# EasyEDA Pro project 酒精视觉检测.eprj

# Schematic 酒精疲劳检测
Board Name: Board1; Create Date: 2025-12-30; Page Name: P1; Project Name: 酒精视觉检测; Schematic Name: 酒精疲劳检测; Update Date: 2025-12-30; Company: 嘉立创EDA; Page Size: A4; Version: V1.0
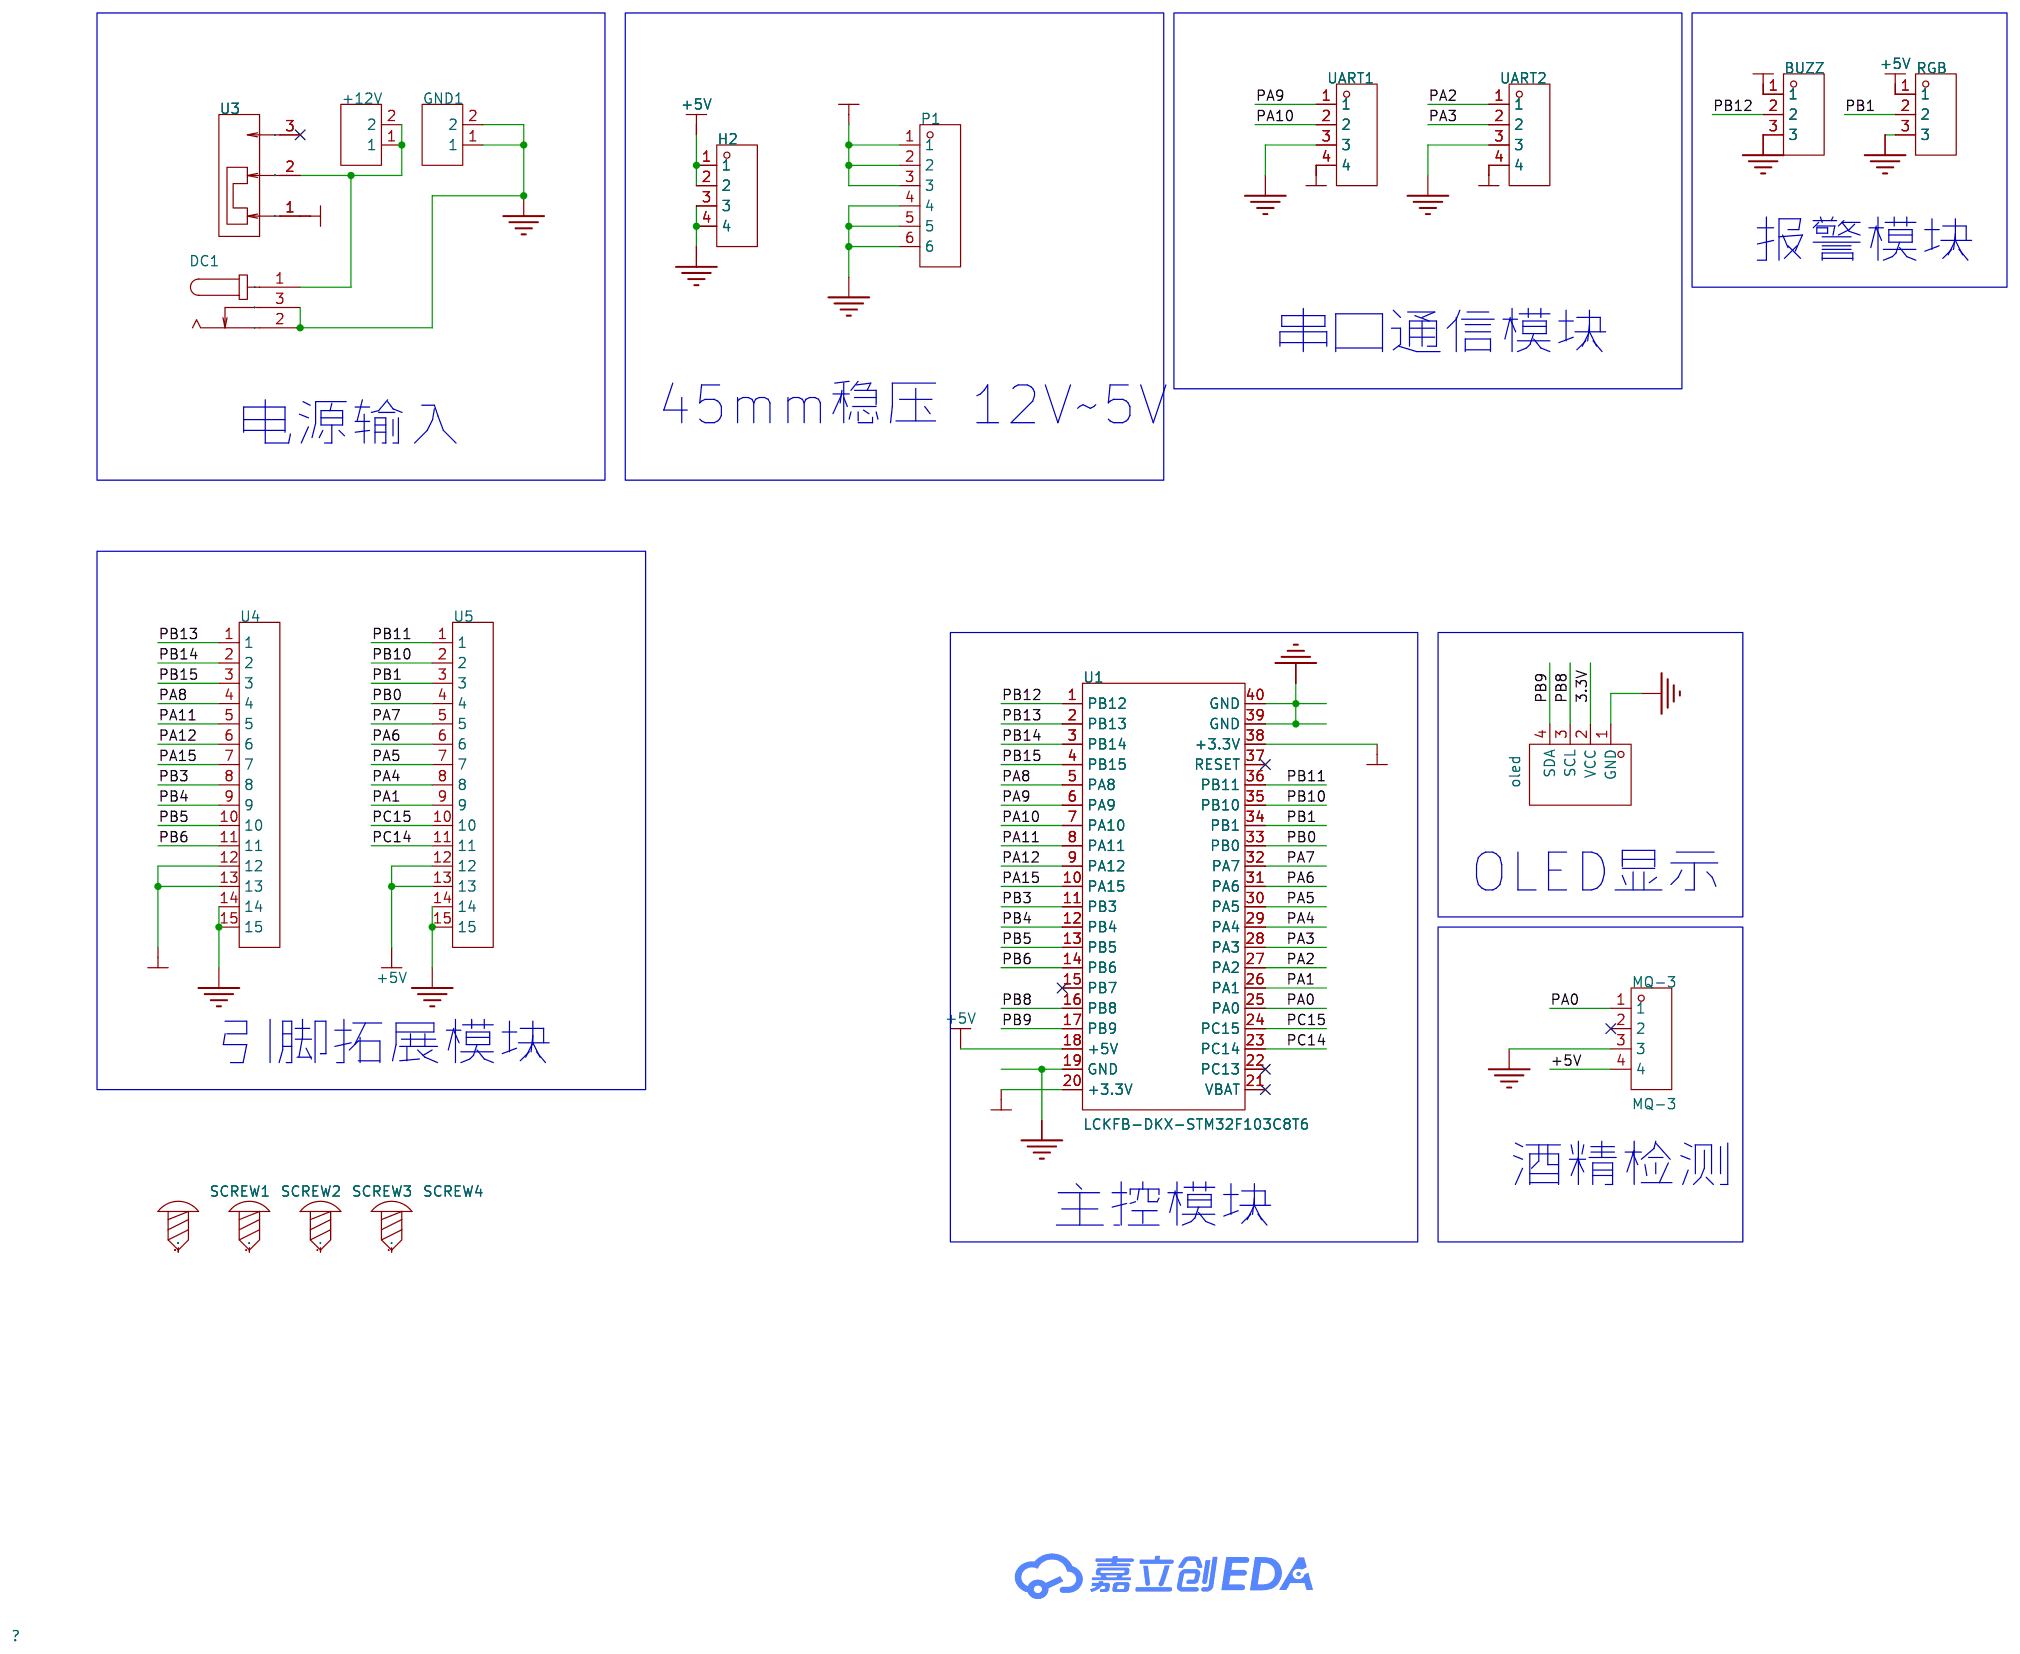
[diagram p0: schematic sheet]

## Parts
+12V  Z-211-0211-0021-001  [HDR-TH_2P-P2.54-V-M-1]
BUZZ  HC-PM254-8.5H-1x3PZ-02A  [HDR-TH_3P-P2.54-V-F]
DC1  DC005-T  [DC-IN-TH_DC005-T]
GND1  Z-211-0211-0021-001  [HDR-TH_2P-P2.54-V-M-1]
H2  2.54-1*4P母  [HDR-TH_4P-P2.54-V-F]
MQ-3  MQ-3  [HDR-TH_4P-P2.54-V-F]
oled  HS96L03W2C03  [OLED-TH_L27.8-W27.2-P2.54_C9900033791]
P1  2.54-1*6P母  [HDR-TH_6P-P2.54-V-F]
RGB  HC-PM254-8.5H-1x3PZ-02A  [HDR-TH_3P-P2.54-V-F]
SCREW1  -  [M2螺丝]
SCREW2  -  [M2螺丝]
SCREW3  -  [M2螺丝]
SCREW4  -  [M2螺丝]
U1  LCKFB-DKX-STM32F103C8T6  [CONN-TH_L53.3-W22.9_STM32F103C8T6-CARD]
U3  SS-12D10-G5  [SW-TH_SS-12D10-G050]
U4  ZX-PZ2.54-1-15PZZ  [HDR-TH_15P-P2.54-V-M]
U5  ZX-PZ2.54-1-15PZZ  [HDR-TH_15P-P2.54-V-M]
UART1  PZ254V-11-04P  [HDR-TH_4P-P2.54-V-M]
UART2  PZ254V-11-04P  [HDR-TH_4P-P2.54-V-M]

## Library data of the parts
+12V GND1 = Z-211-0211-0021-001: LCSC Part Name: 1x2P 间距:2.54mm 方针 直插; Supplier Part: C152154; Manufacturer: Nextron(正凌); Supplier Footprint: 插件,P=2.54mm; JLCPCB Part Class: 扩展库; Datasheet: https://item.szlcsc.com/datasheet/Z-211-0211-0021-001/163494.html; Supplier: LCSC; Pin Structure: 1x2P; Pitch: 2.54mm; Circluar Pins/Square Pins: 方针; Mounting Type: 直插; Number of Rows: 单排; Number of Pins: 2P; Length of Mating Pin: 6mm; Insulation Height: 2.5mm; Length of End Connection Pin: 3mm; Contact Material: 黄铜; Operating Temperature: -25℃~+105℃; Color: 黑色
BUZZ RGB = HC-PM254-8.5H-1x3PZ-02A: LCSC Part Name: 间距2.54mm 1x3Pin 直插 PC3.0 H8.5; Supplier Part: C22373889; Manufacturer: HC(虹成电子); Supplier Footprint: 插件,P=2.54mm; JLCPCB Part Class: 扩展库; Datasheet: https://item.szlcsc.com/datasheet/HC-PM254-8.5H-1x3PZ-02A/23870225.html; Supplier: LCSC; Holes Structure: 1x3P; Pitch: 2.54mm; Circular Hole / Square Hole: 方孔; Mounting Type: 直插; Number of Rows: 单排; Number of Positions: 3P; Current Rating: 3A; Holes Direction: 顶部; Insulation Height: 8.5mm; Contact Material: 黄铜; Contact Plating: 金; Operating Temperature: -40℃~+105℃; PIN Length: 3mm
DC1 = DC005-T: LCSC Part Name: DC电源插座 内径:2mm 外径:6.3mm; Supplier Part: C431532; Manufacturer: SHOU HAN(首韩); Supplier Footprint: 插件; JLCPCB Part Class: 扩展库; Datasheet: https://item.szlcsc.com/datasheet/DC005-T/427889.html; Supplier: LCSC; Connector Type: DC电源插座; Mounting Type: 弯插; Inside Contact Diameter: 2mm; Outside Contact Diameter: 6.3mm; Current Rating: 1.5A; Voltage Rating (Max): 12V; Operating Temperature: -30℃~+70℃
H2 = 2.54-1*4P母: LCSC Part Name: 间距:2.54mm 1x4P 直插; Supplier Part: C2718488; Manufacturer: BOOMELE(博穆精密); Supplier Footprint: 插件,P=2.54mm; JLCPCB Part Class: 扩展库; Datasheet: https://item.szlcsc.com/datasheet/2.54-1*4P%25E6%25AF%258D/2834502.html; Supplier: LCSC; Holes Structure: 1x4P; Pitch: 2.54mm; Circular Hole / Square Hole: 方孔; Mounting Type: 直插; Number of Rows: 单排; Number of Positions: 4P; Current Rating: 3A; Holes Direction: 顶部; Contact Material: 青铜; Operating Temperature: -40℃~+105℃
MQ-3 = PM254V-11-04-H85: LCSC Part Name: 1x4P 间距:2.54mm 直插; Supplier Part: C541851; Manufacturer: XFCN(兴飞); Supplier Footprint: 插件,P=2.54mm; JLCPCB Part Class: 扩展库; Datasheet: https://item.szlcsc.com/datasheet/PM254V-11-04-H85/562472.html; Supplier: LCSC; Holes Structure: 1x4P; Pitch: 2.54mm; Circular Hole / Square Hole: 方孔; Mounting Type: 直插; Number of Rows: 单排; Number of Positions: 4P; Current Rating: 3A; Holes Direction: 顶部; Insulation Height: 8.5mm; Contact Material: 黄铜; Operating Temperature: -40℃~+105℃
oled = HS96L03W2C03: LCSC Part Name: 0.96寸OLED显示屏窄白光IIC; Supplier Part: C5248080; Manufacturer: HS(汉昇); JLCPCB Part Class: 扩展库; Datasheet: https://atta.szlcsc.com/upload/public/pdf/source/20230627/763D01F79A90007632F098068C7C8AD9.pdf; Supplier: LCSC; Main Control Chip: SSD1315; Interface Type: I2C; Size: 0.96; Pixel Resolution: 128x64; Operating Temperature: -40℃~+70℃
P1 = 2.54-1*6P母: LCSC Part Name: 1x6P 间距:2.54mm 直插; Supplier Part: C40877; Manufacturer: BOOMELE(博穆精密); Supplier Footprint: 插件,P=2.54mm; JLCPCB Part Class: 扩展库; Datasheet: https://item.szlcsc.com/datasheet/2.54-1*6P%25E6%25AF%258D/41861.html; Supplier: LCSC; Holes Structure: 1x6P; Pitch: 2.54mm; Circular Hole / Square Hole: 方孔; Mounting Type: 直插; Number of Rows: 单排; Number of Positions: 6P; Current Rating: 3A; Holes Direction: 顶部; Contact Material: 黄铜; Operating Temperature: -40℃~+105℃; PIN Length: 3.3mm
SCREW1-SCREW4 = M2螺丝: Supplier Footprint: 插件
U1 = LCKFB-DKX-STM32F103C8T6: LCSC Part Name: 立创·地阔星-STM32F103C8T6开发板; Supplier Part: C22396880; Manufacturer: 立创开发板; JLCPCB Part Class: 扩展库; Datasheet: https://item.szlcsc.com/datasheet/LCKFB-DKX-STM32F103C8T6/24005615.html; Supplier: LCSC
U3 = SS-12D10-G5: LCSC Part Name: 插件大电流拨动开关; Supplier Part: C2998777; Manufacturer: DEALON(德艺隆); Supplier Footprint: 插件,12.7x6.7mm; JLCPCB Part Class: 扩展库; Datasheet: https://item.szlcsc.com/datasheet/SS-12D10-G5/3473878.html; Supplier: LCSC; Circuit: 单刀双掷; Actuator Style: 矩形柱状; Termination Style: PC引脚; Length: 12.7mm; Width: 6.7mm; Switch Height: 11.3mm; Mounting Type: 直插; Actuator Color: 黑色
U4 U5 = ZX-PZ2.54-1-15PZZ: LCSC Part Name: 1x15P 间距:2.54mm 方针 直插; Supplier Part: C7501269; Manufacturer: Megastar(兆星); Supplier Footprint: 插件,P=2.54mm; JLCPCB Part Class: 扩展库; Datasheet: https://item.szlcsc.com/datasheet/ZX-PZ2.54-1-15PZZ/8582482.html; Supplier: LCSC; Pin Structure: 1x15P; Pitch: 2.54mm; Circluar Pins/Square Pins: 方针; Mounting Type: 直插; Number of Rows: 单排; Number of Pins: 15P; Current Rating: 3A; Length of Mating Pin: 6mm; Insulation Height: 2.5mm; Length of End Connection Pin: 3mm; Contact Material: 黄铜; Contact Plating: 金; Operating Temperature: -40℃~+105℃; Color: 黑色
UART1 UART2 = PZ254V-11-04P: LCSC Part Name: 1x4P 间距:2.54mm 方针 直插; Supplier Part: C2691448; Manufacturer: XFCN(兴飞); Supplier Footprint: 插件,P=2.54mm; JLCPCB Part Class: 扩展库; Datasheet: https://item.szlcsc.com/datasheet/PZ254V-11-04P/2801085.html; Supplier: LCSC; Pin Structure: 1x4P; Pitch: 2.54mm; Circluar Pins/Square Pins: 方针; Mounting Type: 直插; Number of Rows: 单排; Number of Pins: 4P; Current Rating: 3A; Voltage Rating (Max): 250V; Length of Mating Pin: 6mm; Insulation Height: 2.5mm; Length of End Connection Pin: 3mm; Operating Temperature: -40℃~+105℃; Color: 黑色

## Nets
3.3V: BUZZ.1 oled.2(VCC) U1.20(+3.3V) U1.38(+3.3V) U4.12 U4.13 UART1.4 UART2.4
+5V: H2.1 H2.2 MQ-3.4 RGB.1 U1.18(+5V) U5.12 U5.13
+12V: P1.1 P1.2 P1.3 U3.1
GND: BUZZ.3 DC1.2 DC1.3 GND1.1 GND1.2 H2.3 H2.4 MQ-3.3 oled.1(GND) P1.4 P1.5 P1.6 RGB.3 U1.19(GND) U1.39(GND) U1.40(GND) U4.14 U4.15 U5.14 U5.15 UART1.3 UART2.3
PA0: MQ-3.1 U1.25(PA0)
PA1: U1.26(PA1) U5.9
PA2: U1.27(PA2) UART2.1
PA3: U1.28(PA3) UART2.2
PA4: U1.29(PA4) U5.8
PA5: U1.30(PA5) U5.7
PA6: U1.31(PA6) U5.6
PA7: U1.32(PA7) U5.5
PA8: U1.5(PA8) U4.4
PA9: U1.6(PA9) UART1.1
PA10: U1.7(PA10) UART1.2
PA11: U1.8(PA11) U4.5
PA12: U1.9(PA12) U4.6
PA15: U1.10(PA15) U4.7
PB0: U1.33(PB0) U5.4
PB1: RGB.2 U1.34(PB1) U5.3
PB3: U1.11(PB3) U4.8
PB4: U1.12(PB4) U4.9
PB5: U1.13(PB5) U4.10
PB6: U1.14(PB6) U4.11
PB8: oled.3(SCL) U1.16(PB8)
PB9: oled.4(SDA) U1.17(PB9)
PB10: U1.35(PB10) U5.2
PB11: U1.36(PB11) U5.1
PB12: BUZZ.2 U1.1(PB12)
PB13: U1.2(PB13) U4.1
PB14: U1.3(PB14) U4.2
PB15: U1.4(PB15) U4.3
PC14: U1.23(PC14) U5.11
PC15: U1.24(PC15) U5.10
$1N3227: +12V.1 +12V.2 DC1.1 U3.2

Not connected (* = marked no-connect by the designer): MQ-3 2*; SCREW1 1; SCREW2 1; SCREW3 1; SCREW4 1; U1 15(PB7)* 21(VBAT)* 22(PC13)* 37(RESET)*; U3 3*

## Notes on the sheet
- 报警模块
- 串口通信模块
- 45mm稳压 12V~5V
- 电源输入
- OLED显示
- 引脚拓展模块
- 酒精检测
- 主控模块

# Board PCB1
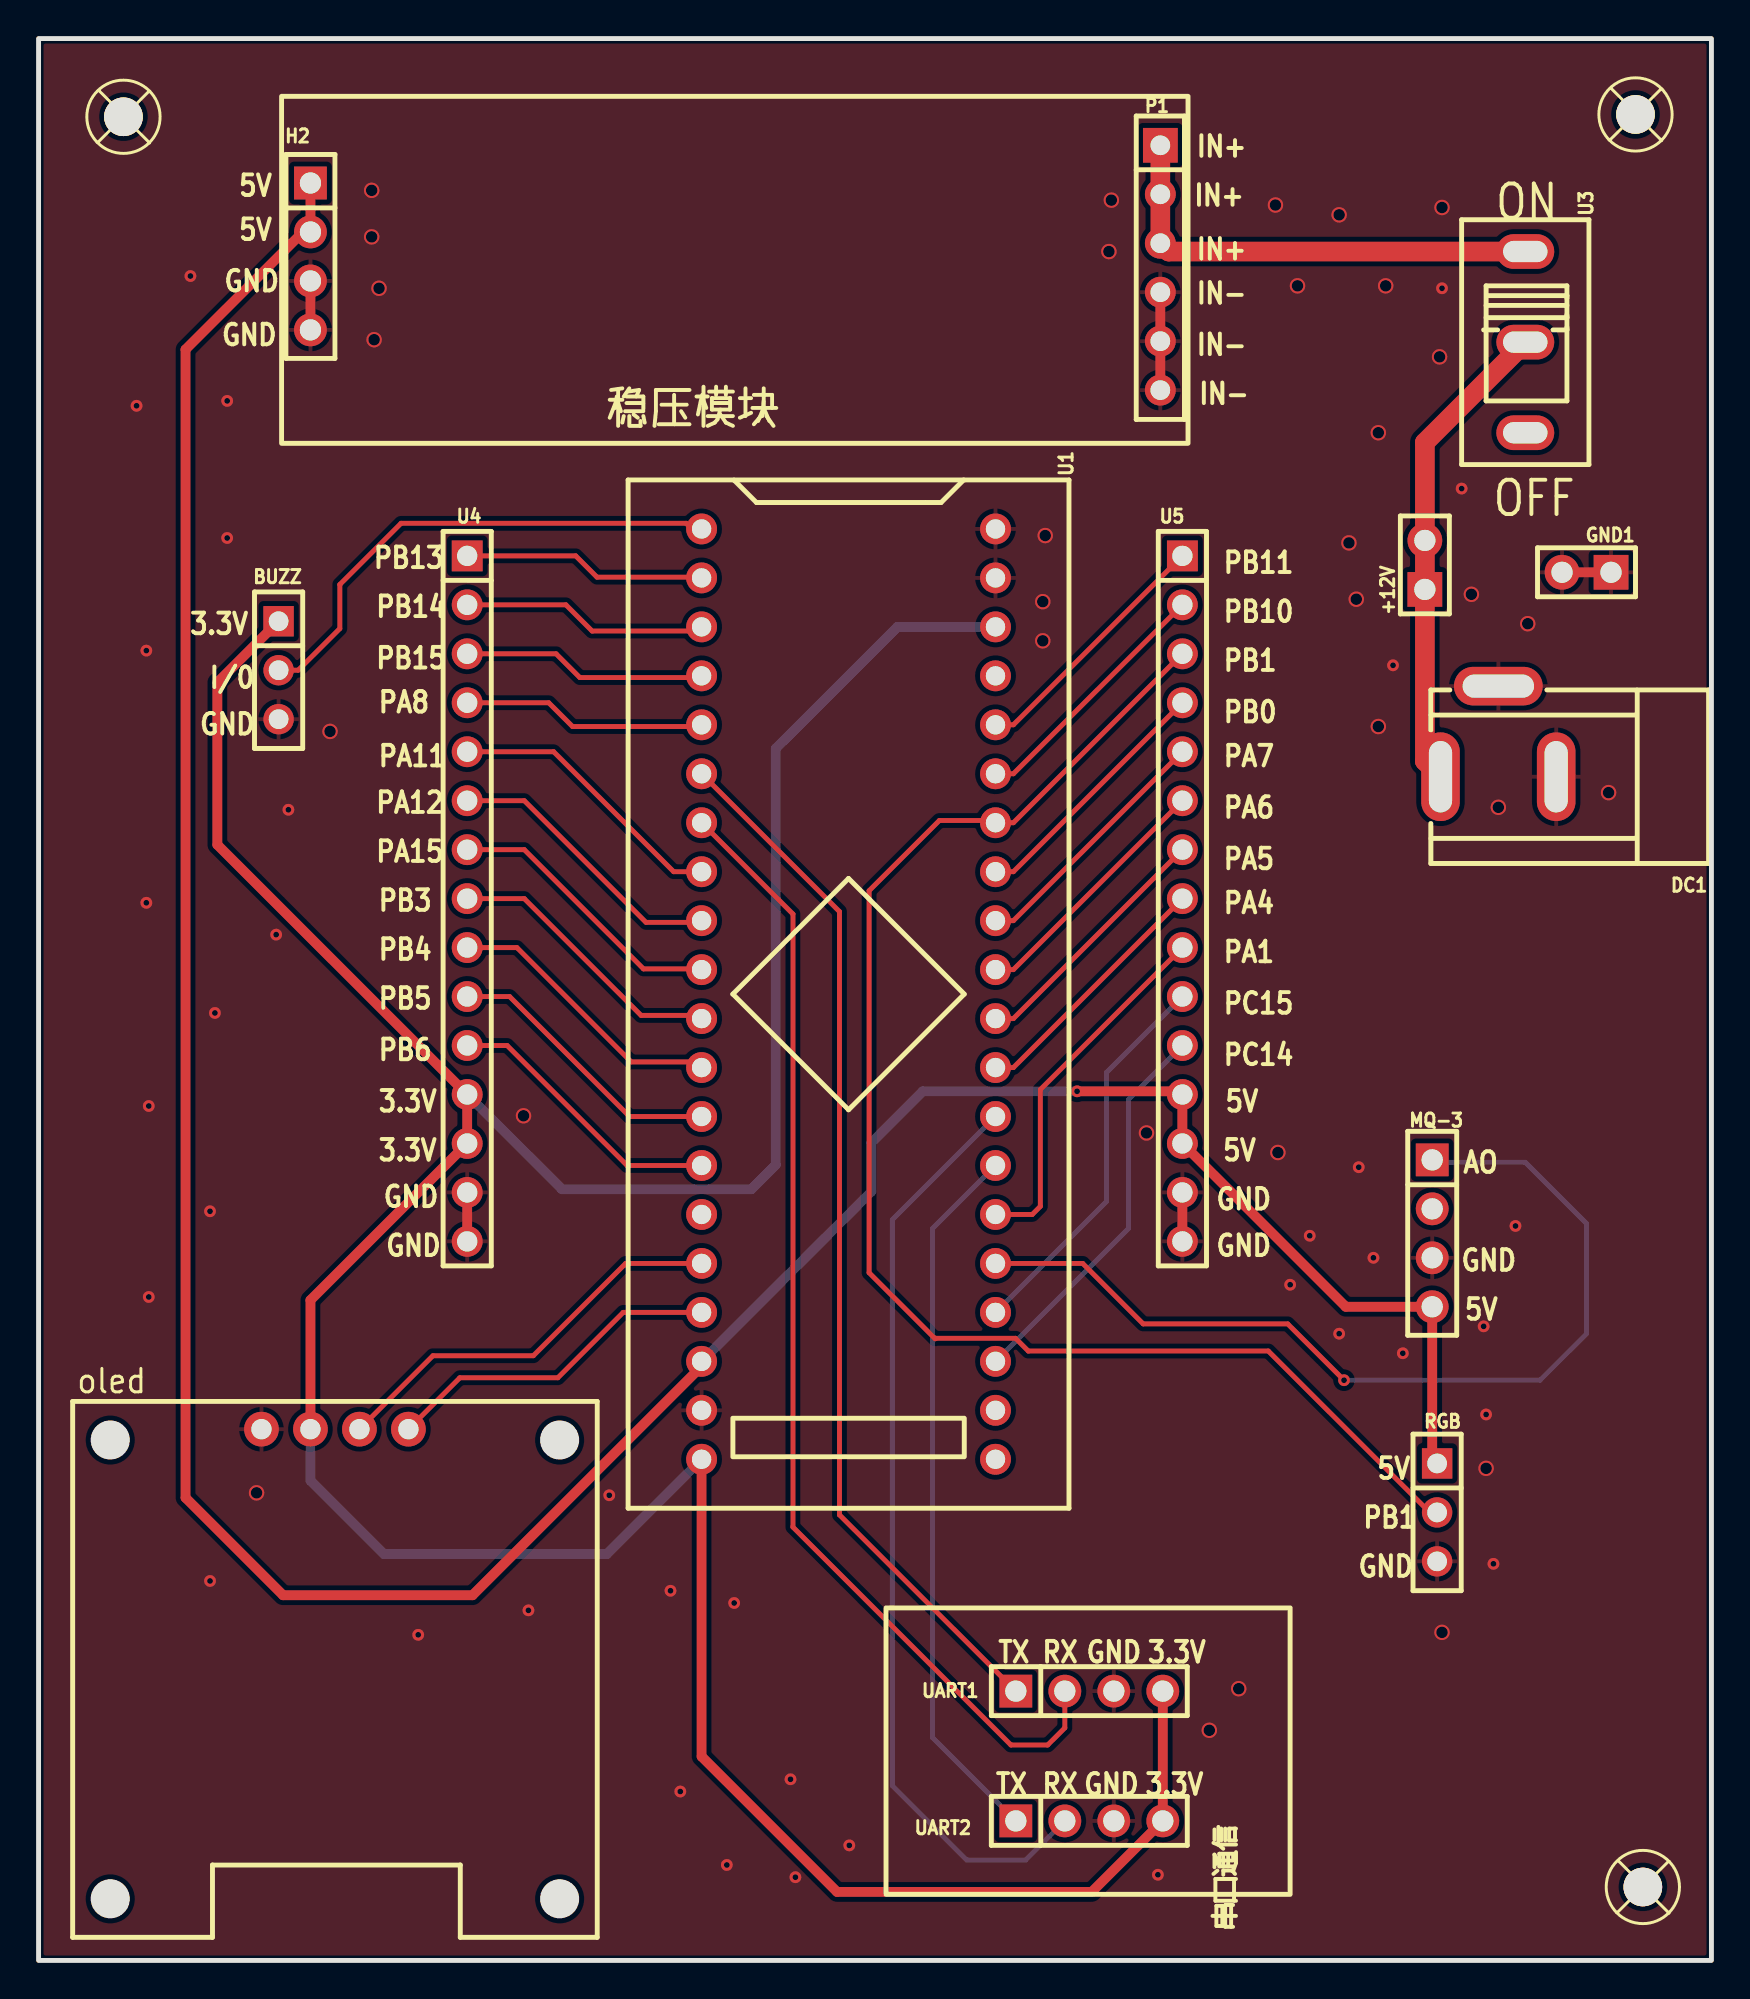
[diagram p1: board, top side]
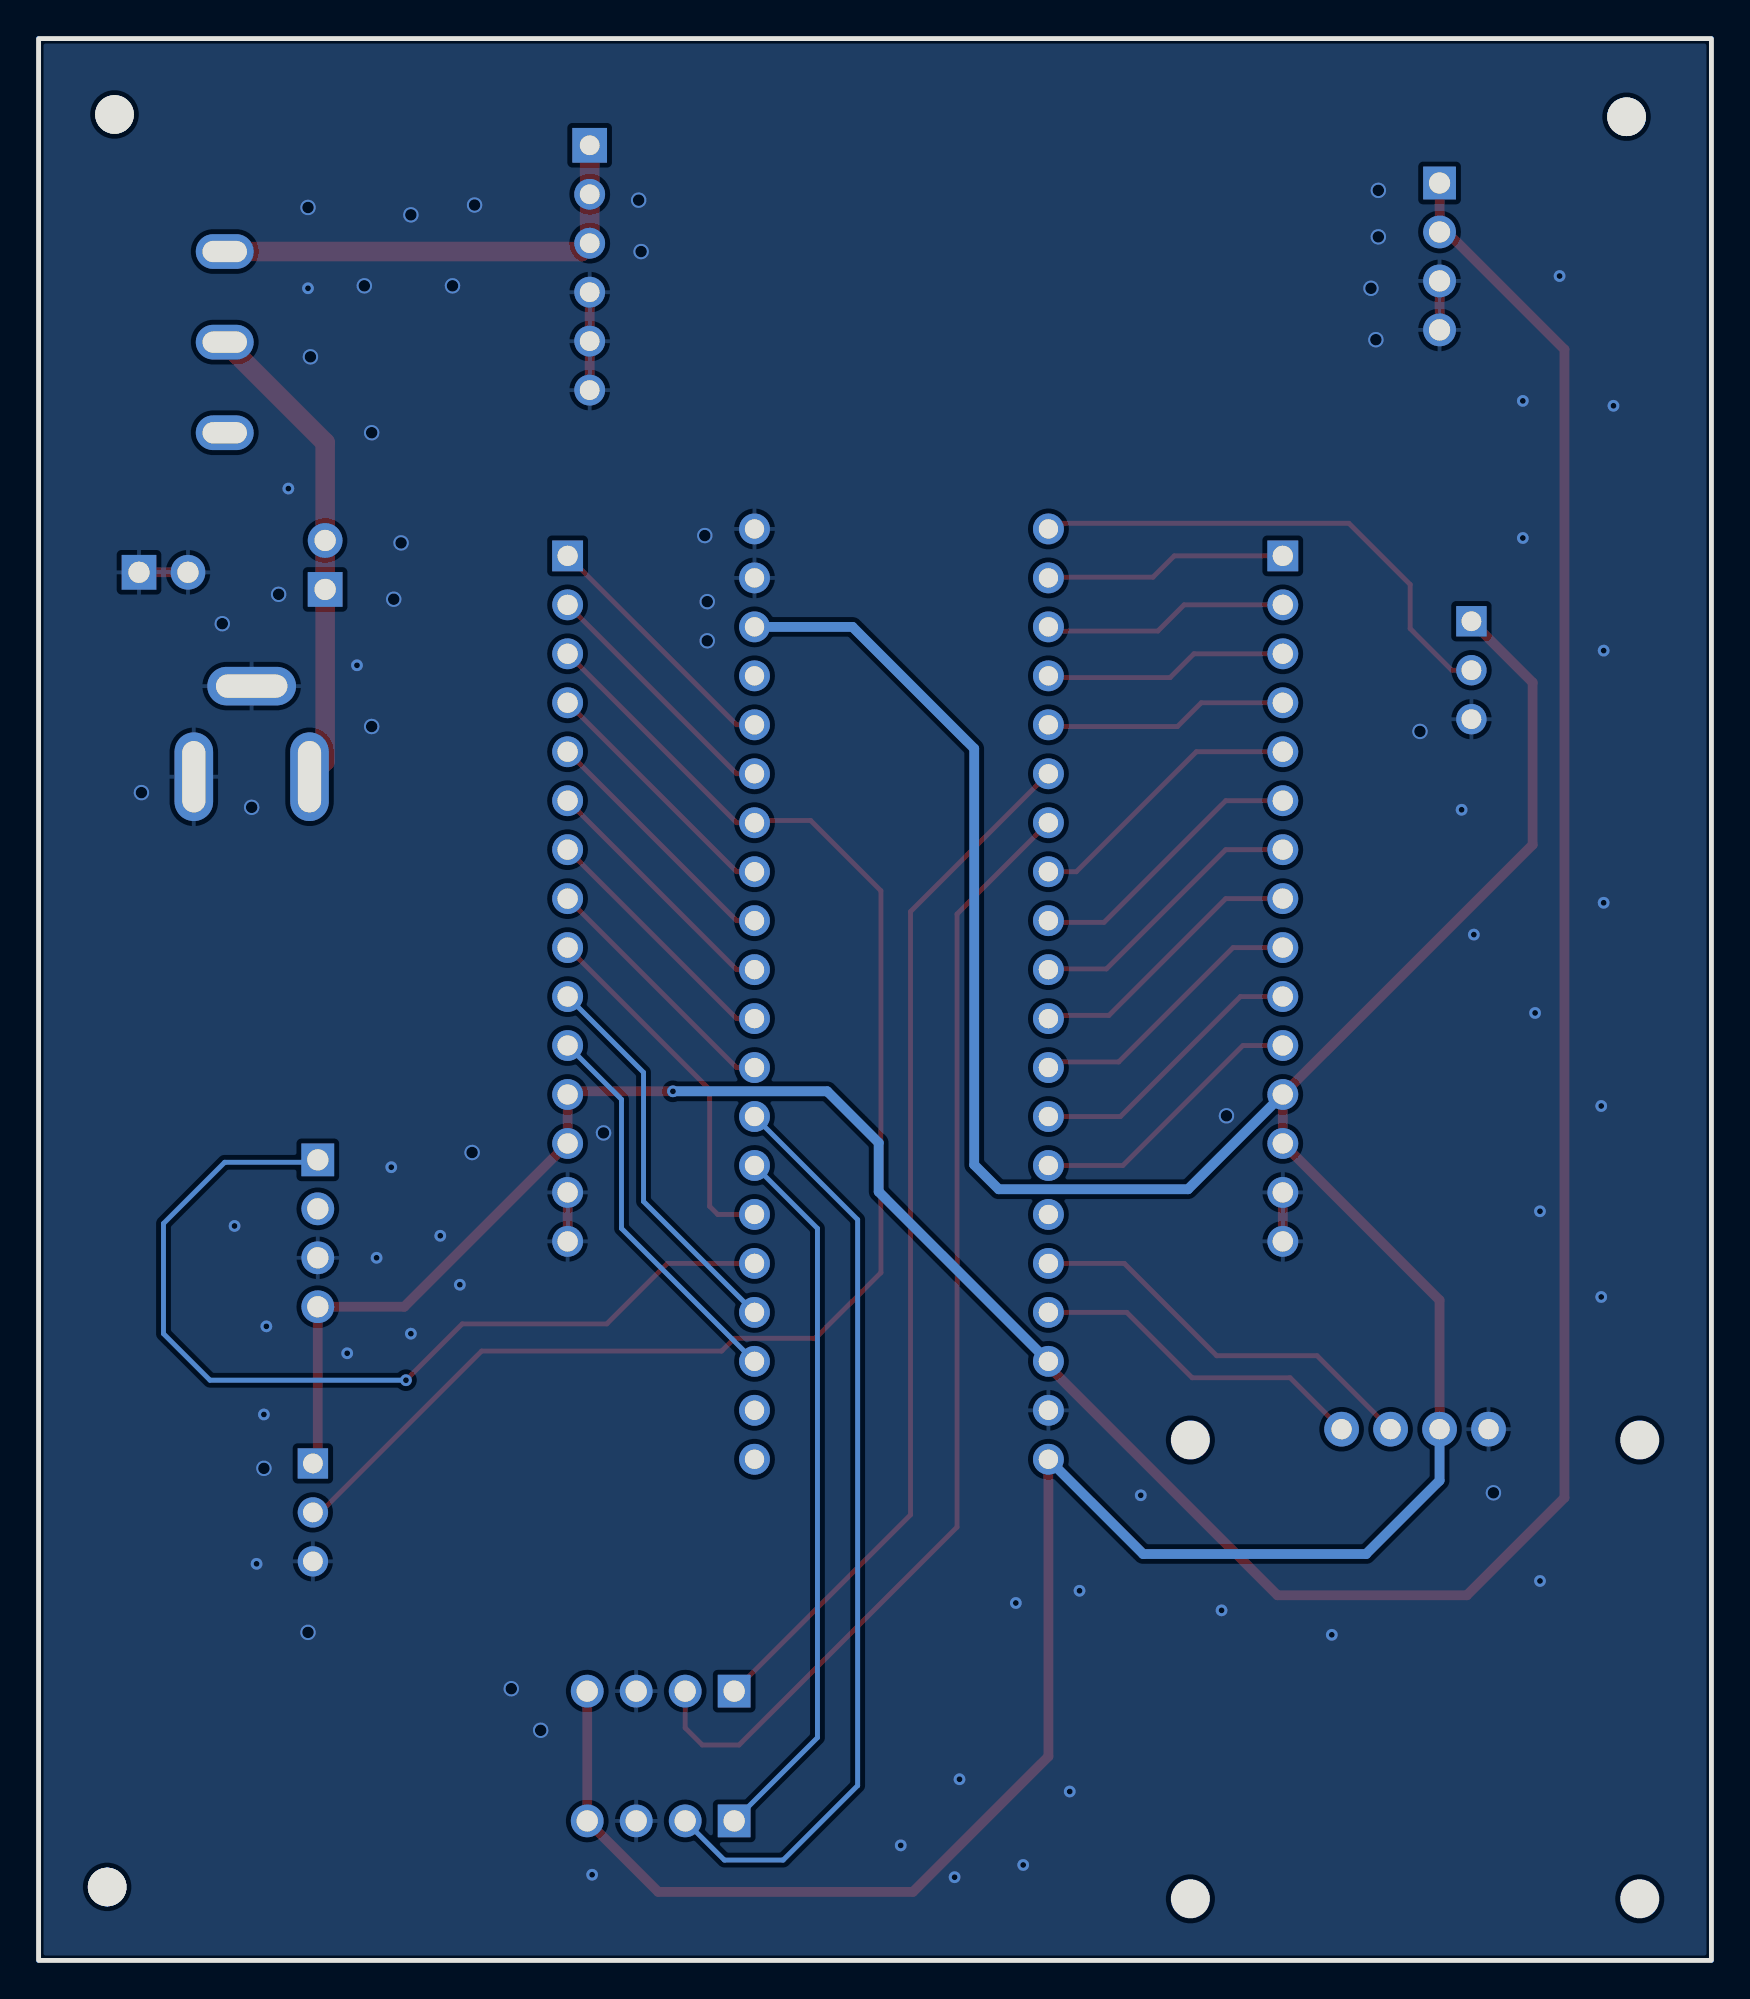
[diagram p2: board, bottom side, seen from below]

Outline 86.74 x 99.7 mm; copper layers: Top Layer, Bottom Layer. Coordinates in mm from the lower left corner of the outline.
Outline path: rectangle 0,99.7 86.74,0
Stack: Top Layer 0.035mm / Dielectric1 1.51mm FR4 er 4.5 / Bottom Layer 0.035mm

## Design rules (mm)
template: JLCPCB Capability(Two Layers Board)
spacing copperThickness1oz (default): track to track 0.102, other pairs 0.152 to 0.3
spacing copperThickness2oz: track to track 0.203, other pairs 0.152 to 0.3
track width copperThickness1oz (default): min 0.127, default 0.254, max 2.54
track width copperThickness2oz: min 0.203, default 0.254, max 2.54
differential pair differentialPair (default): width min 0.127, default 0.254, max 2.54; gap min 0.152, default 0.152
via viaSize (default): diameter min 0.5, default 0.61, max 10; hole min 0.3, default 0.305, max 6.3

## Placement (name value [footprint] x y rotation side)
+12V  Z-211-0211-0021-001  [HDR-TH_2P-P2.54-V-M-1]  71.88 72.39 90 top
BUZZ  HC-PM254-8.5H-1x3PZ-02A  [HDR-TH_3P-P2.54-V-F]  12.45 66.93 270 top
DC1  DC005-T  [DC-IN-TH_DC005-T]  75.69 63.75 180 top
GND1  Z-211-0211-0021-001  [HDR-TH_2P-P2.54-V-M-1]  80.26 72.01 180 top
H2  2.54-1*4P母  [HDR-TH_4P-P2.54-V-F]  14.1 88.39 270 top
MQ-3  MQ-3  [HDR-TH_4P-P2.54-V-F]  72.26 37.72 270 top
oled  HS96L03W2C03  [OLED-TH_L27.8-W27.2-P2.54_C9900033791]  15.37 27.56 0 top
P1  2.54-1*6P母  [HDR-TH_6P-P2.54-V-F]  58.17 87.81 270 top
RGB  HC-PM254-8.5H-1x3PZ-02A  [HDR-TH_3P-P2.54-V-F]  72.52 23.24 270 top
SCREW2  -  [M2螺丝]  82.8 95.76 0 top
SCREW3  -  [M2螺丝]  4.4 95.64 0 top
SCREW4  -  [M2螺丝]  83.19 3.81 0 top
U1  LCKFB-DKX-STM32F103C8T6  [CONN-TH_L53.3-W22.9_STM32F103C8T6-CARD]  42 50.13 270 top
U3  SS-12D10-G5  [SW-TH_SS-12D10-G050]  77.09 83.95 270 top
U4  ZX-PZ2.54-1-15PZZ  [HDR-TH_15P-P2.54-V-M]  22.22 55.08 270 top
U5  ZX-PZ2.54-1-15PZZ  [HDR-TH_15P-P2.54-V-M]  59.31 55.08 270 top
UART1  PZ254V-11-04P  [HDR-TH_4P-P2.54-V-M]  54.48 13.97 0 top
UART2  PZ254V-11-04P  [HDR-TH_4P-P2.54-V-M]  54.48 7.24 0 top

## Footprints (pads in the part's own frame, mm; a bottom-side part is the same pattern mirrored in y, then rotated)
CONN-TH_L53.3-W22.9_STM32F103C8T6-CARD
  round 1.6 hole 1: 1(-24.13,-7.62) 2(-21.59,-7.62) 3(-19.05,-7.62) 4(-16.51,-7.62) 5(-13.97,-7.62) 6(-11.43,-7.62) 7(-8.89,-7.62) 8(-6.35,-7.62) 9(-3.81,-7.62) 10(-1.27,-7.62) 11(1.27,-7.62) 12(3.81,-7.62) 13(6.35,-7.62) 14(8.89,-7.62) 15(11.43,-7.62) 16(13.97,-7.62) 17(16.51,-7.62) 18(19.05,-7.62) 19(21.59,-7.62) 20(24.13,-7.62) 21(24.13,7.62) 22(21.59,7.62) 23(19.05,7.62) 24(16.51,7.62) 25(13.97,7.62) 26(11.43,7.62) 27(8.89,7.62) 28(6.35,7.62) 29(3.81,7.62) 30(1.27,7.62) 31(-1.27,7.62) 32(-3.81,7.62) 33(-6.35,7.62) 34(-8.89,7.62) 35(-11.43,7.62) 36(-13.97,7.62) 37(-16.51,7.62) 38(-19.05,7.62) 39(-21.59,7.62) 40(-24.13,7.62)
DC-IN-TH_DC005-T
  oval 2x4.6 hole 1.2x3.7: 1(2.999,2.35) 2(-2.999,2.35)
  oval 4.6x2 hole 3.7x1.2: 3(0,-2.35)
HDR-TH_2P-P2.54-V-M-1
  rect 1.8x1.8 hole 1.1: 1(-1.27,0)
  round 1.8 hole 1.1: 2(1.27,0)
HDR-TH_3P-P2.54-V-F
  rect 1.575x1.575 hole 1.02: 1(-2.54,0)
  round 1.575 hole 1.02: 2(0,0) 3(2.54,0)
HDR-TH_4P-P2.54-V-F
  rect 1.7x1.7 hole 1.1: 1(-3.81,0)
  round 1.7 hole 1.1: 2(-1.27,0) 3(1.27,0) 4(3.81,0)
HDR-TH_4P-P2.54-V-M
  rect 1.7x1.7 hole 1.1: 1(-3.81,0)
  round 1.7 hole 1.1: 2(-1.27,0) 3(1.27,0) 4(3.81,0)
HDR-TH_6P-P2.54-V-F
  rect 1.8x1.8 hole 1.02: 1(-6.35,0)
  round 1.6 hole 1.02: 2(-3.81,0) 3(-1.27,0) 4(1.27,0) 5(3.81,0) 6(6.35,0)
HDR-TH_15P-P2.54-V-M
  rect 1.6x1.6 hole 1.05: 1(-17.78,0)
  round 1.6 hole 1.05: 2(-15.24,0) 3(-12.7,0) 4(-10.16,0) 5(-7.62,0) 6(-5.08,0) 7(-2.54,0) 8(0,0) 9(2.54,0) 10(5.08,0) 11(7.62,0) 12(10.16,0) 13(12.7,0) 14(15.24,0) 15(17.78,0)
M2螺丝
  round 2 hole 2: 1(0,0)
OLED-TH_L27.8-W27.2-P2.54_C9900033791
  round 1.8 hole 1.05: 1(-3.81,0) 2(-1.27,0) 3(1.27,0) 4(3.81,0)
SW-TH_SS-12D10-G050
  oval 1.8x3 hole 1.1x2.3: 1(-4.7,0) 2(0,0) 3(4.7,0)

## Nets
As in the schematic.

Pads without a net: MQ-3 2; SCREW2 1; SCREW3 1; SCREW4 1; U1 15 21 22 37; U3 3

## Via types
v1: diameter 0.61, hole 0.305, Top Layer to Bottom Layer, 39 vias
v2: diameter 0.8, hole 0.6, Top Layer to Bottom Layer, 32 vias

## Routing (per net, layer and track width the routed paths; a pad name or vN(x,y) marks a point on that pad's centre or on a via; arc(x,y) is an arc through that point)
3.3V: length 183.2
  Top Layer w0.508: oled.2 14.1,34.25 U4.13 U4.12 9.27,57.87 9.27,66.29 BUZZ.1 ; UART1.4 UART2.4 54.61,3.56 41.4,3.56 34.38,10.58 U1.20
  Bottom Layer w0.508: U1.20 29.46,21.08 17.91,21.08 14.1,24.89 oled.2 ; U4.12 27.14,40.01 36.96,40.01 38.23,41.28 38.23,62.87 44.54,69.18 U1.38
+5V: length 164.7
  Top Layer w0.508: U1.18 34.38,30.82 22.5,18.95 12.68,18.95 7.62,24 7.62,83.57 13.72,89.66 H2.2 H2.1 ; v1(53.85,45.09) 59.14,45.09 U5.12 U5.13 67.78,33.91 MQ-3.4 72.26,26.04 RGB.1
  Bottom Layer w0.508: U1.18 43.18,39.88 43.18,42.42 45.85,45.09 v1(53.85,45.09)
+12V: length 24.2
  Top Layer w1.016: P1.1 P1.2 P1.3 58.6,88.65 U3.1
GND: length 15.2
  Top Layer w0.508: 59.31,39.84 U5.15 ; H2.3 H2.4 ; 58.17,86.54 P1.5 P1.6 ; 78.99,72.01 GND1.1 ; 22.22,39.84 U4.15
  vias: v1(5.08,80.65) v1(5.59,67.95) v1(5.59,54.86) v1(5.71,44.32) v1(5.71,34.42) v1(7.87,87.38) v1(8.89,38.86) v1(8.89,19.69) v1(9.14,49.15) v1(9.78,80.9) v1(9.78,73.79) v1(12.32,53.21) v1(12.95,59.69) v1(19.69,16.89) v1(25.4,18.16) v1(29.59,24.13) v1(32.77,19.18) v1(33.27,8.76) v1(35.69,4.95) v1(36.07,18.54) v1(38.99,9.4) v1(39.24,4.32) v1(42.04,5.97) v1(58.04,4.45) v1(64.9,35.05) v1(65.91,37.59) v1(67.44,32.51) v1(68.45,41.15) v1(69.22,36.45) v1(70.23,67.18) v1(70.74,31.5) v1(72.77,86.74) v1(73.79,76.35) v1(74.93,32.89) v1(75.06,28.32) v1(75.44,20.57) v1(76.58,38.1) v2(11.3,24.26) v2(15.11,63.75) v2(17.27,91.82) v2(17.27,89.41) v2(17.4,84.07) v2(17.65,86.74) v2(25.15,43.82) v2(52.07,70.49) v2(52.07,68.45) v2(52.2,73.91) v2(55.5,88.65) v2(55.63,91.31) v2(57.45,42.93) v2(60.71,11.94) v2(62.23,14.1) v2(64.13,91.06) v2(64.26,41.91) v2(65.28,86.87) v2(67.44,90.55) v2(67.94,73.53) v2(68.33,70.61) v2(69.47,79.25) v2(69.47,64.01) v2(69.85,86.87) v2(72.64,83.19) v2(72.77,90.93) v2(72.77,17.02) v2(74.29,70.87) v2(75.06,25.53) v2(75.69,59.82) v2(77.22,69.34) v2(81.41,60.58)
PA0: length 49.2
  Top Layer w0.254: U1.25 54.14,36.16 57.28,33.02 64.77,33.02 v1(67.69,30.1)
  Bottom Layer w0.254: v1(67.69,30.1) 77.85,30.1 80.26,32.51 80.26,38.23 77.09,41.4 72.39,41.4 MQ-3.1
PA1: length 19
  Top Layer w0.254: U1.26 51.52,38.7 51.94,39.12 51.94,45.17 U5.9
PA2: length 37.1
  Bottom Layer w0.254: UART2.1 46.35,11.56 46.35,37.97 U1.27
PA3: length 48.3
  Bottom Layer w0.254: UART2.2 51.18,5.21 48.13,5.21 44.27,9.07 44.27,38.43 U1.28
PA4: length 13.3
  Top Layer w0.254: U1.29 50.55,46.32 U5.8
PA5: length 13.3
  Top Layer w0.254: 59.31,57.62 50.55,48.86 U1.30
PA6: length 13.3
  Top Layer w0.254: U1.31 50.55,51.4 U5.6
PA7: length 13.3
  Top Layer w0.254: 59.31,62.7 50.55,53.94 U1.32
PA8: length 12.7
  Top Layer w0.254: U1.5 34.29,64.01 27.69,64.01 26.45,65.24 U4.4
PA9: length 54.3
  Top Layer w0.254: U1.6 41.53,54.41 41.53,23.11 UART1.1
PA10: length 59.6
  Top Layer w0.254: UART1.2 53.21,12.06 52.32,11.18 50.42,11.18 39.12,22.48 39.12,54.28 U1.7
PA11: length 14.7
  Top Layer w0.254: U1.8 32.93,56.48 26.71,62.7 22.22,62.7
PA12: length 14.8
  Top Layer w0.254: U1.9 34.29,53.85 31.5,53.85 25.18,60.16 U4.6
PA15: length 14.7
  Top Layer w0.254: U1.10 34.34,51.44 31.37,51.44 25.18,57.62 22.22,57.62
PB0: length 13.3
  Top Layer w0.254: U5.4 50.55,56.48 U1.33
PB1: length 75.9
  Top Layer w0.254: U5.3 50.55,59.02 U1.34 49.61,59.01 49.12,59.01 49,59.13 46.71,59.13 43.06,55.49 43.06,35.68 46.49,32.25 46.52,32.27 50.66,32.27 51.32,31.61 63.76,31.61 72.15,23.23 72.51,23.23 RGB.2
PB3: length 14.7
  Top Layer w0.254: U4.8 25.18,55.08 31.24,49.02 34.21,49.02 U1.11
PB4: length 14.7
  Top Layer w0.254: U1.12 34.09,46.61 30.73,46.61 24.8,52.54 U4.9
PB5: length 14.7
  Top Layer w0.254: U4.10 24.42,50 30.64,43.78 U1.13
PB6: length 14.7
  Top Layer w0.254: U4.11 24.29,47.46 30.52,41.24 U1.14
PB8: length 21.3
  Top Layer w0.254: oled.3 20.45,31.37 25.65,31.37 30.44,36.16 U1.16
PB9: length 17.7
  Top Layer w0.254: oled.4 21.84,30.23 26.92,30.23 30.31,33.62 U1.17
PB10: length 13.3
  Top Layer w0.254: U1.35 50.55,61.56 U5.2
PB11: length 13.3
  Top Layer w0.254: U1.36 50.55,64.1 U5.1
PB12: length 26.5
  Top Layer w0.254: U1.1 33.87,74.26 33.58,74.55 18.8,74.55 15.62,71.37 15.62,69.09 13.46,66.93 BUZZ.2
PB13: length 12.6
  Top Layer w0.254: U4.1 27.85,72.86 28.96,71.76 34.34,71.76 U1.2
PB14: length 12.8
  Top Layer w0.254: U1.3 34.16,68.96 28.7,68.96 27.34,70.32 U4.2
PB15: length 12.7
  Top Layer w0.254: U1.4 34.29,66.55 28.07,66.55 26.84,67.78 U4.3
PC14: length 20.4
  Bottom Layer w0.254: U1.23 56.51,37.97 56.51,44.67 U5.11
PC15: length 20.4
  Bottom Layer w0.254: U5.10 55.37,46.06 55.37,39.37 U1.24
$1N3227: length 25
  Top Layer w1.016: U3.2 71.88,78.74 +12V.2 71.88,62.21 DC1.1

## Copper pours and planes (outline as drawn; the poured copper is in the pictures)
GND on Top Layer: -3.56,101.73 87.5,101.73 87.5,-1.91 -3.56,-1.91
GND on Bottom Layer: -2.67,102.36 88.52,102.36 88.52,-2.41 -2.67,-2.41

## Text on the board
Top Silkscreen Layer: 3.3V | GND | I/0 | 5V | PB13 | PB14 | PB15 | PA12 | PA15 | PA8 | PA11 | PB3 | PB4 | PB5 | PB6 | TX | RX | IN+ | IN- | PB11 | PB10 | PB1 | PB0 | PA7 | PA6 | PA5 | PA4 | PA1 | PC15 | PC14 | AO | OFF | ON | 串口通信 | 稳压模块
